# Altium schematic sheet 06 USB & PWR.SchDoc
size 513 x 386 mm
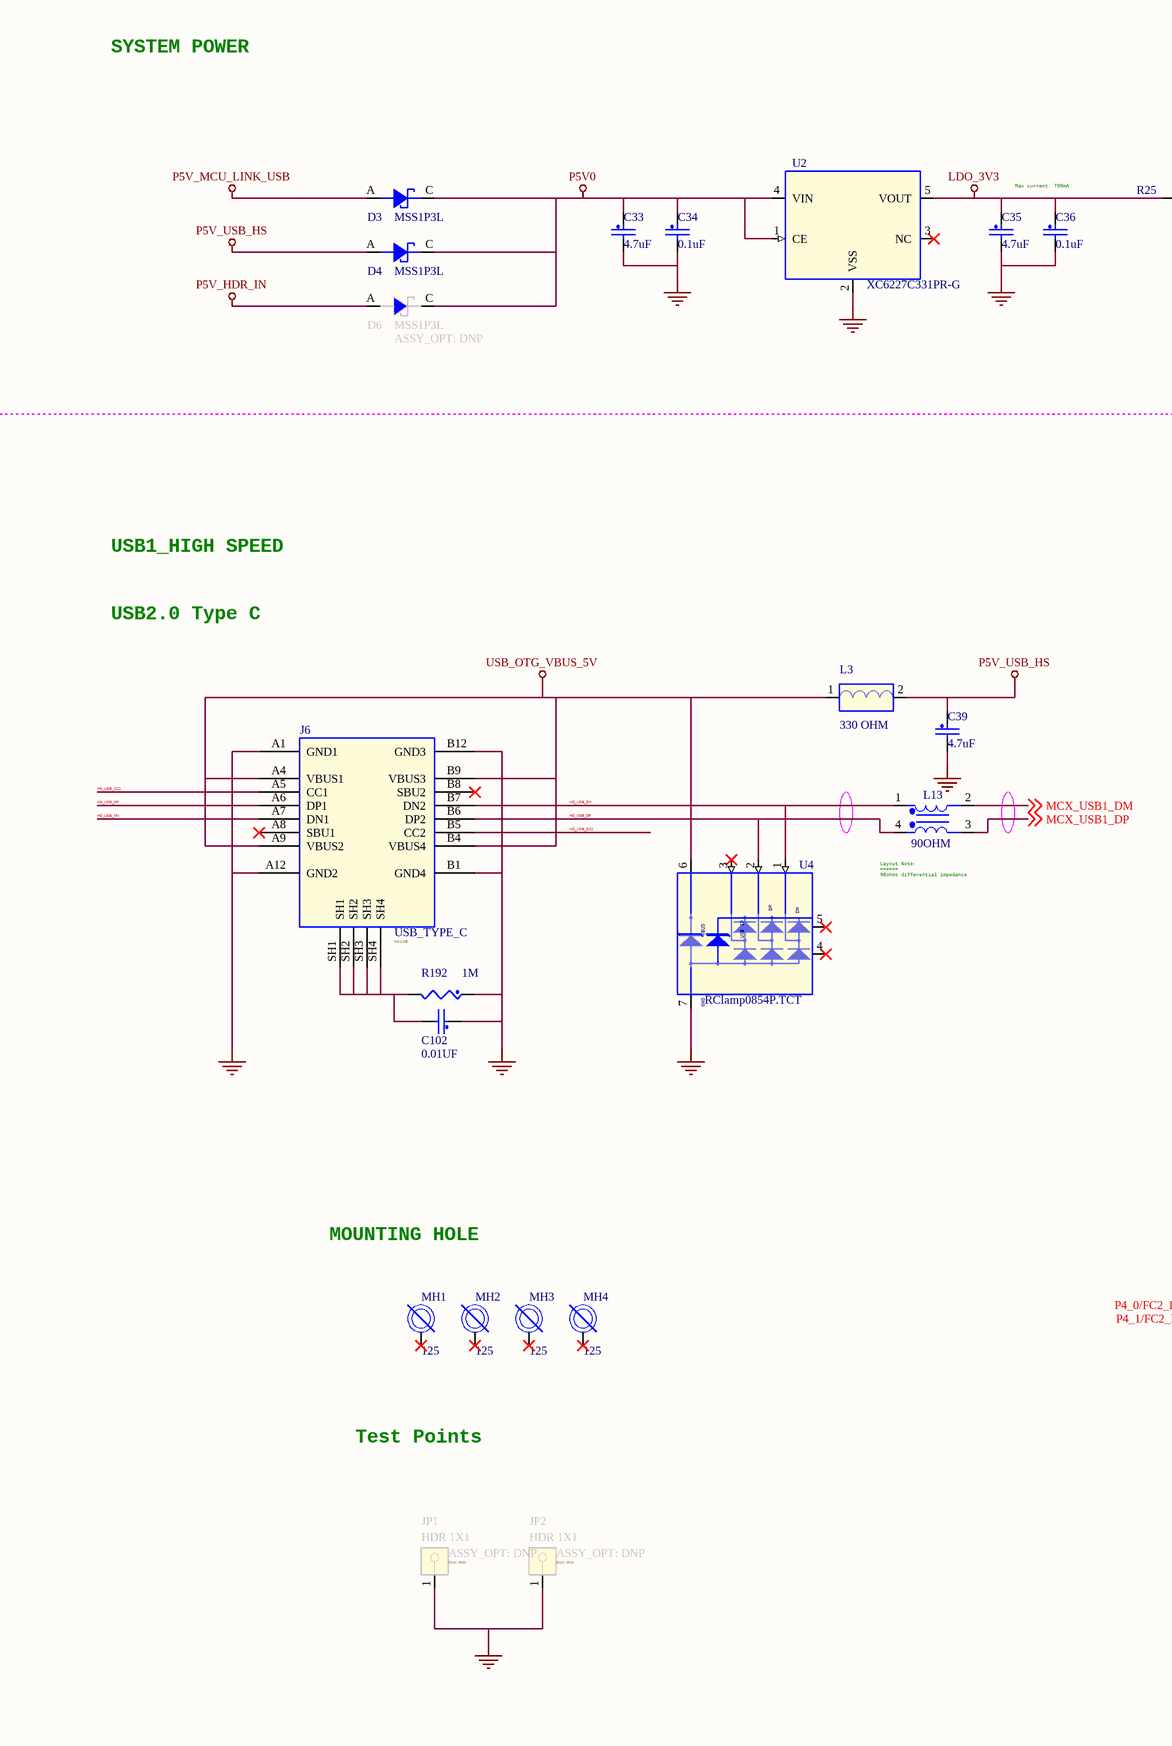
[diagram p0: 06 USB & PWR.SchDoc, left]
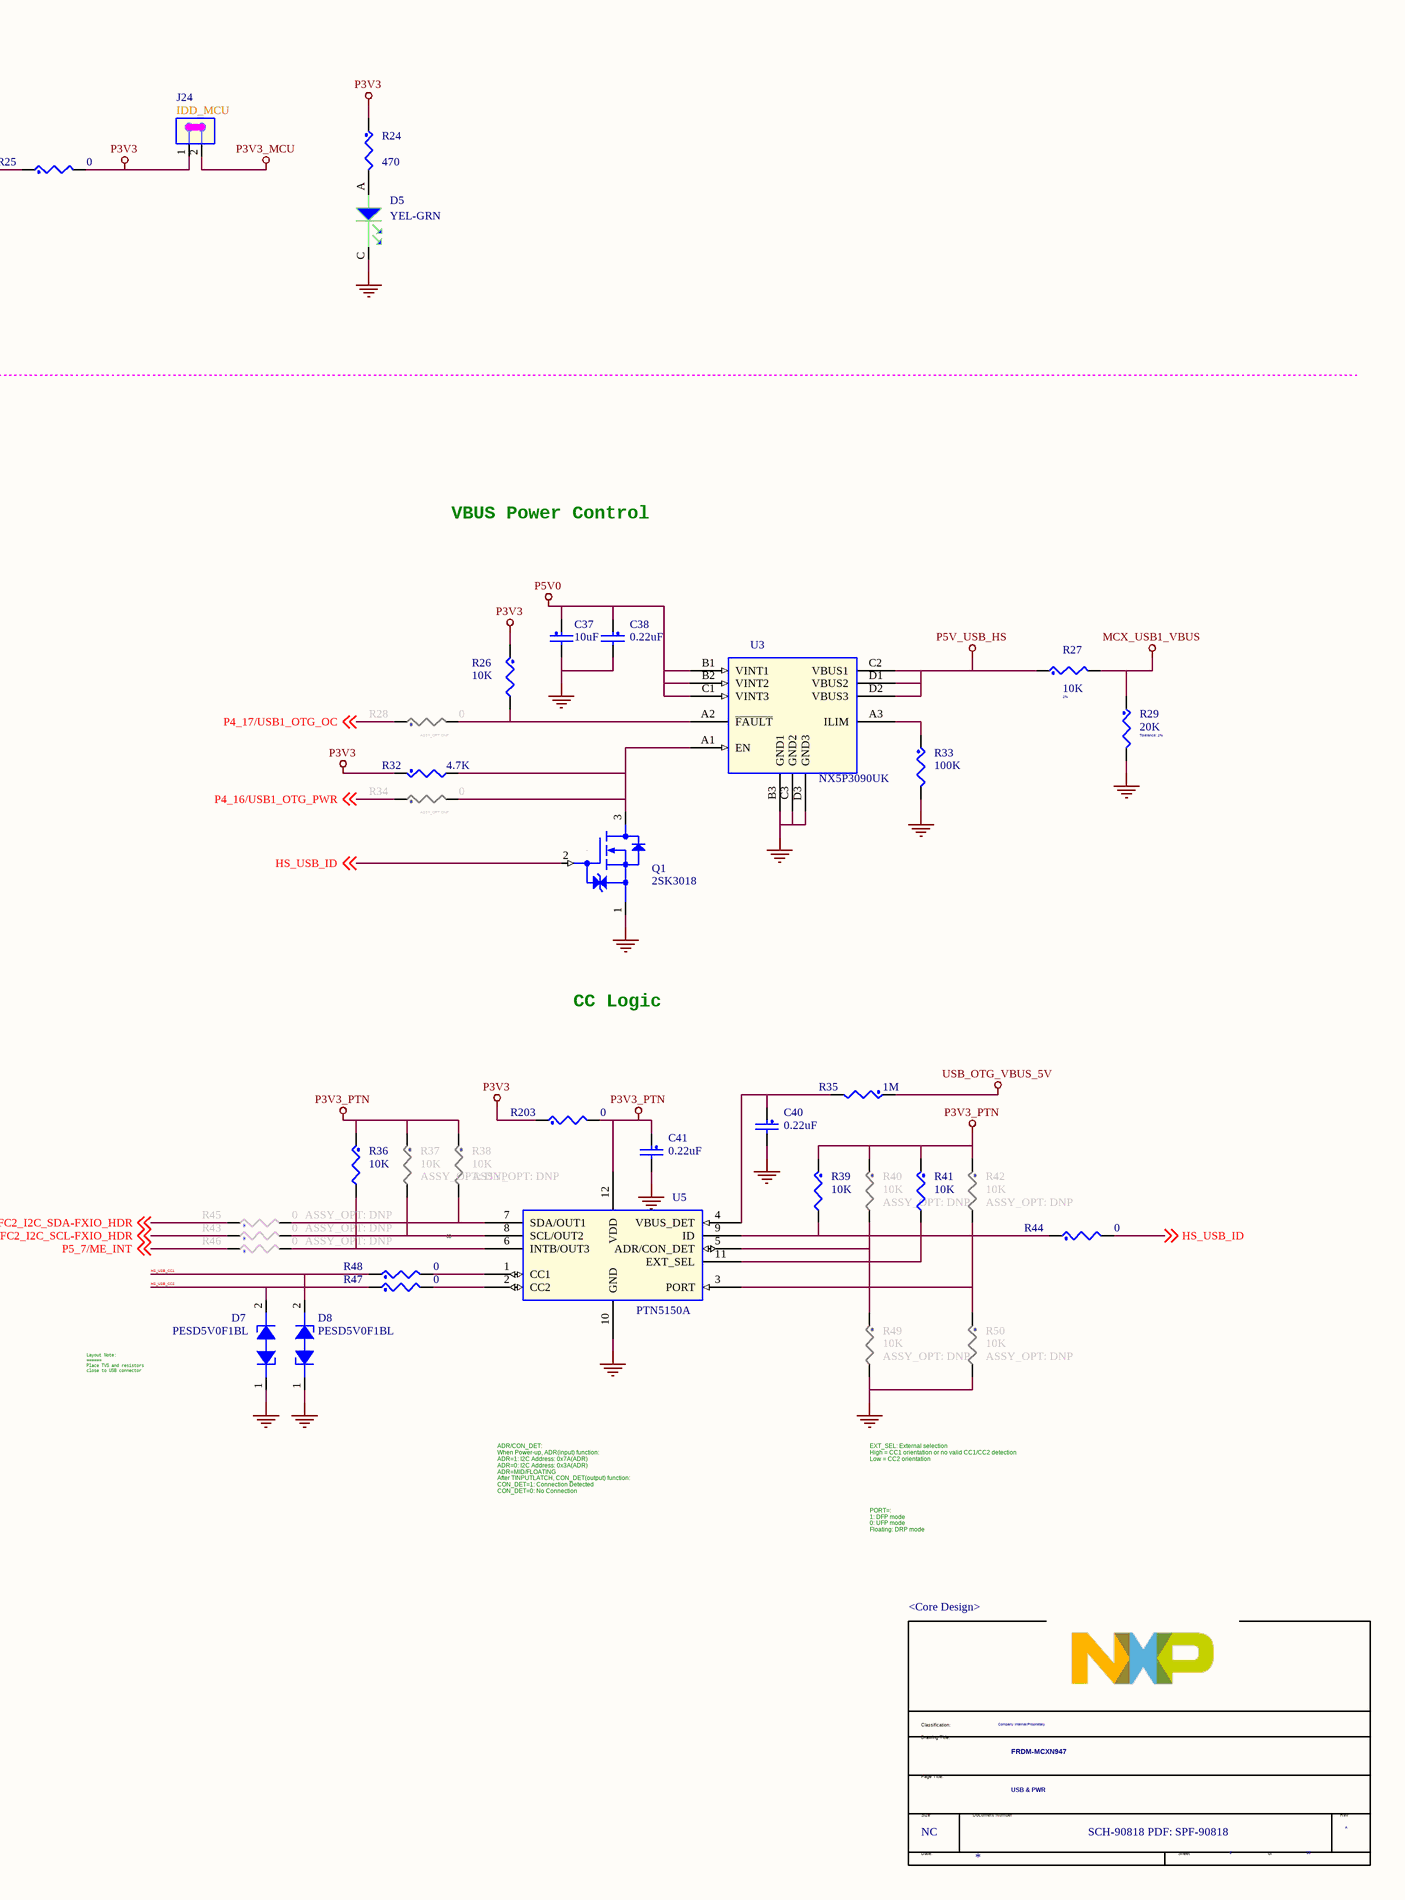
[diagram p1: 06 USB & PWR.SchDoc, right]

## Parts
*  Doc: SCH-90818 PDF: SPF-90818  RevCode: A  Title: FRDM-MCXN947  Page Size: NC  Page Number: 6  Page Count: 13  PageTitle: USB & PWR  Variant Name: <Core Design>  Classification: Company Internal/Proprietary  (hidden comment: TitleBlock_FS)  (graphical)
C33  4.7uF  [CC0603_OV]
C34  0.1uF  [CC0402_25]
C35  4.7uF  [CC0603_OV]
C36  0.1uF  [CC0402_25]
C37  10uF  [CC0603_OV]
C38  0.22uF  [CC0402_25]
C39  4.7uF  [CC0603_OV]
C40  0.22uF  [CC0402_25]
C41  0.22uF  [CC0402_25]
C102  0.01UF  [CC0805_OV]
D3  MSS1P3L  [smb_2p7x1p4]
D4  MSS1P3L  [smb_2p7x1p4]
D5  YEL-GRN  [led_1x0p6_sm]
D6  MSS1P3L  ASSY_OPT: DNP  [smb_2p7x1p4]
D7  PESD5V0F1BL  [sod882]
D8  PESD5V0F1BL  [sod882]
J6  USB_TYPE_C  SILK: HS-USB  [con16_usb_type-c_ra_th]
J24  SILK: IDD_MCU  [hdr1x2_5p48x2p69]  (hidden comment: HDR1X2)
JP1  HDR 1X1  ASSY_OPT: DNP  SILK: GND  [HDR101]
JP2  HDR 1X1  ASSY_OPT: DNP  SILK: GND  [HDR101]
L3  330 OHM  [ind_1608]
L13  90OHM  [ind4_choke_0805_39h]
MH1  125  [MH125-160]
MH2  125  [MH125-160]
MH3  125  [MH125-160]
MH4  125  [MH125-160]
Q1  2SK3018  [SOT323_3]
R24  470  [RC0402_25]
R25  0  [RC0603_OV]
R26  10K  [RC0402_25]
R27  10K  Tolerance: 1%  [RC0402_25]
R28  0  ASSY_OPT: DNP  [RC0603_OV]
R29  20K  Tolerance: 1%  [RC0402_25]
R32  4.7K  [RC0402_25]
R33  100K  [RC0402_25]
R34  0  ASSY_OPT: DNP  [RC0603_OV]
R35  1M  [RC0805_OV]
R36  10K  [RC0402_25]
R37  10K  ASSY_OPT: DNP  [RC0402_25]
R38  10K  ASSY_OPT: DNP  [RC0402_25]
R39  10K  [RC0402_25]
R40  10K  ASSY_OPT: DNP  [RC0402_25]
R41  10K  [RC0402_25]
R42  10K  ASSY_OPT: DNP  [RC0402_25]
R43  0  ASSY_OPT: DNP  [RC0402_25]
R44  0  [RC0603_OV]
R45  0  ASSY_OPT: DNP  [RC0402_25]
R46  0  ASSY_OPT: DNP  [RC0402_25]
R47  0  [RC0402_25]
R48  0  [RC0402_25]
R49  10K  ASSY_OPT: DNP  [RC0402_25]
R50  10K  ASSY_OPT: DNP  [RC0402_25]
R192  1M  [RC0805_OV]
R203  0  [RC0402_25]
U2  XC6227C331PR-G  [SOT89-5]
U3  NX5P3090UK  [wlcsp12_0p4_1p38x1p68mm_smdp]
U4  RClamp0854P.TCT  [slp1616p6]
U5  PTN5150A  [x2qfn12_0p4_1p6x1p6]

## Nets
GND: C33.2 C34.2 C35.2 C36.2 C37.2 C38.2 C39.2 C40.2 C41.2 C102.1 D5.C(CATHODE) D7.1(C1) D8.1(C1) J6.A1(GND1) J6.A12(GND2) J6.B1(GND4) J6.B12(GND3) JP1.1 JP2.1 Q1.1(SOURCE) R29.2 R33.2 R49.2 R50.2 R192.1 U2.2(VSS) U3.B3(GND1) U3.C3(GND2) U3.D3(GND3) U4.7(GND) U5.10(GND)
LDO_3V3: C35.1 C36.1 R25.1 U2.5(VOUT)
MCX_USB1_VBUS: R27.2 R29.1
P3V3: J24.1 R24.1 R25.2 R26.1 R32.1 R203.1
P3V3_MCU: J24.2
P3V3_PTN: C41.1 R36.1 R37.1 R38.1 R39.1 R40.1 R41.1 R42.1 R203.2 U5.12(VDD)
P5V0: C33.1 C34.1 C37.1 C38.1 D3.C D4.C D6.C U2.1(CE) U2.4(VIN) U3.B1(VINT1) U3.B2(VINT2) U3.C1(VINT3)
P5V_HDR_IN: D6.A
P5V_MCU_LINK_USB: D3.A
P5V_USB_HS: C39.1 D4.A L3.2 R27.1 U3.C2(VBUS1) U3.D1(VBUS2) U3.D2(VBUS3)
USB_OTG_VBUS_5V: J6.A4(VBUS1) J6.A9(VBUS2) J6.B4(VBUS4) J6.B9(VBUS3) L3.1 R35.1 U4.6(VBUS)
HS_USB_CC1: D8.2(C2) J6.A5(CC1) R48.1
HS_USB_CC2: D7.2(C2) J6.B5(CC2) R47.1
HS_USB_DN: J6.A7(DN1) J6.B7(DN2) L13.1 U4.1(DM)
HS_USB_DP: J6.A6(DP1) J6.B6(DP2) L13.4 U4.2(DP)
HS_USB_ID: Q1.2(GATE) R44.2 ; off-sheet HS_USB_ID
MCX_USB1_DM: L13.2 ; off-sheet MCX_USB1_DM
MCX_USB1_DP: L13.3 ; off-sheet MCX_USB1_DP
P4_0/FC2_I2C_SDA-FXIO_HDR: R45.1 ; off-sheet P4_0/FC2_I2C_SDA-FXIO_HDR
P4_1/FC2_I2C_SCL-FXIO_HDR: R43.1 ; off-sheet P4_1/FC2_I2C_SCL-FXIO_HDR
P4_16/USB1_OTG_PWR: R34.1 ; off-sheet P4_16/USB1_OTG_PWR
P4_17/USB1_OTG_OC: R28.1 ; off-sheet P4_17/USB1_OTG_OC
P5_7/ME_INT: R46.1 ; off-sheet P5_7/ME_INT
NetC40_1: C40.1 R35.2 U5.4(VBUS_DET)
NetC102_2: C102.2 J6.SH1 J6.SH2 J6.SH3 J6.SH4 R192.2
NetD5_A: D5.A(ANODE) R24.2
NetQ1_3: Q1.3(DRAIN) R32.2 R34.2 U3.A1(EN)
NetR26_2: R26.2 R28.2 U3.A2(~{FAULT})
NetR33_1: R33.1 U3.A3(ILIM)
NetR36_2: R36.2 R46.2 U5.6(INTB/OUT3)
NetR37_2: R37.2 R43.2 U5.8(SCL/OUT2)
NetR38_2: R38.2 R45.2 U5.7(SDA/OUT1)
NetR39_2: R39.2 R44.1 U5.9(ID)
NetR40_2: R40.2 R49.1 U5.5(ADR/CON_DET)
NetR41_2: R41.2 U5.11(EXT_SEL)
NetR42_2: R42.2 R50.1 U5.3(PORT)
NetR47_2: R47.2 U5.2(CC2)
NetR48_2: R48.2 U5.1(CC1)

Not connected (* = marked no-connect by the designer): J6 A8(SBU1)* B8(SBU2)*; MH1 1*; MH2 1*; MH3 1*; MH4 1*; U2 3(NC)*; U4 3(USB_ID)* 4(NC1)* 5(NC2)*

## Notes on the sheet
- SYSTEM POWER
- Max current: 700mA
- USB1_HIGH SPEED
- VBUS Power Control
- USB2.0 Type C
- (near L13) Layout Note:
  ======
  90ohms differential impedance
- CC Logic
- MOUNTING HOLE
- OD
- Test Points
- (near D7) Layout Note:
  ======
  Place TVS and resistors
  close to USB connector
- ADR/CON_DET:
  When Power-up, ADR(input) function:
  ADR=1: I2C Address: 0x7A(ADR)
  ADR=0: I2C Address: 0x3A(ADR)
  ADR=MID/FLOATING
  After TINPUTLATCH, CON_DET(output) function:
  CON_DET=1: Connection Detected
  CON_DET=0: No Connection
- EXT_SEL: External selection
  High = CC1 orientation or no valid CC1/CC2 detection
  Low = CC2 orientation
- PORT=:
  1: DFP mode
  0: UFP mode
  Floating: DRP mode
- (in symbol TitleBlock_FS) Classification:; Drawing Title:; Page Title:; Size; Document Number; Rev; Date:; Sheet; of

## Library data of the parts
* = TitleBlock_FS: Classification: Public, Company Internal/Proprietary, Company Confidential,  Company Secret; OrgName: NXP Semiconductors; OrgAddr1: 6501 William Cannon Drive West; OrgAddr2: Austin, TX 78735-8598; Page Create Date: March  8, 1995; Page Modify Date: *
C33 C35 = CAP_NP: CAP CER 4.7uF 10V 20% X5R 0603; CLASS: DISCRETE; Temp Range: -55C TO 85C; TOL: 10%; FPLIST: CC0603_OV,CC0603,0603_CC; CAD_APPROVED: Yes; MFG_PN01: 885012106012; MFG_NAME01: WURTH ELEKTRONIK; AGILE_PN: 150-81893; ROOM: CPU; SIGNAL_MODEL: DEFAULT_CAPACITOR_220000pF_2_1; 3D_Mechanical_Footprint_File: http://fcl.am.freescale.net/ALLEGRO/step/cc0603_ov.STEP; Rated Voltage: 10V; Package Type: WCAP-CSGP_0603; Package Size: 0603; VOLTAGE: 10V; WVDC: 10V; HEIGHT: 0.87MM; ROHS: Yes; Tolerance: 20%; PCB Footprint: CC0603_OV
C34 C36 = CAP_NP: CAP CER 0.1UF 16V 10% X7R 0402; CLASS: DISCRETE; SIGNAL_MODEL: DEFAULT_CAPACITOR_100000pF_2_1; AGILE_PN: 150-75182; MFG_NAME01: Samsung Electro-Mechanics; MFG_PN01: CL05B104KO5NNNC; CAD_APPROVED: Yes; FPLIST: CC0402_25,CC0402_HD,0402_CC,CAPC0402_L,cc0402_lamp3; Temp_Range: -55°C to +85°C; Temp Range: -55C to +125C; Tolerance: 10%; ROHS: Yes; HEIGHT: 0.635MM; VOLTAGE: 16V; Rated Voltage: 16V; 3D_Mechanical_Footprint_File: http://fcl.am.freescale.net/ALLEGRO/step/cc0402_25.STEP; PCB Footprint: CC0402_25
C37 = CAP_NP: CAP CER 10uF 25V 10% X5R 0603; CLASS: DISCRETE; AGILE_PN: 150-79569; CAD_APPROVED: Yes; MFG_NAME01: SANYEAR; MFG_PN01: C0603X5R106K250NT; Package Size: 0603 [1608 Metric]; HEIGHT: 1MM; Package Type: SMD/SMT; Tolerance: 10%; Rated Voltage: 25V; ROHS: Yes; 3D_Mechanical_Footprint_File: http://fcl.am.freescale.net/ALLEGRO/step/cc0603_ov.STEP; PCB Footprint: CC0603_OV
C38 C40 = CAP_NP: CAP CER 0.22UF 16V 10% X7R 0402; CLASS: DISCRETE; Temp Range: -55C to +125C; FPLIST: CC0402_25,CC0402_HD,0402_CC; CAD_APPROVED: Yes; MFG_PN01: 0402B224K160NT; MFG_NAME01: FENGHUA; AGILE_PN: 150-78886; PCB Footprint: CC0402_25; 3D_Mechanical_Footprint_File: http://fcl.am.freescale.net/ALLEGRO/step/cc0402_25.STEP; Rated Voltage: 16V; Package Type: SMD/SMT; Package Size: 0402 [1005 Metric]; VOLTAGE: 16V; HEIGHT: 0.55MM; ROHS: Yes; Tolerance: 10%
C39 = CAP_NP: CAP CER 4.7uF 10V 20% X5R 0603; CLASS: DISCRETE; Temp Range: -55C TO 85C; FPLIST: CC0603_OV,CC0603,0603_CC; CAD_APPROVED: Yes; MFG_PN01: 885012106012; MFG_NAME01: WURTH ELEKTRONIK; AGILE_PN: 150-81893; 3D_Mechanical_Footprint_File: http://fcl.am.freescale.net/ALLEGRO/step/cc0603_ov.STEP; Rated Voltage: 10V; Package Type: WCAP-CSGP_0603; Package Size: 0603; HEIGHT: 0.87MM; ROHS: Yes; Tolerance: 20%; VOLTAGE: 10V; TOL: 20%; PCB Footprint: CC0603_OV
C41 = CAP_NP: CAP CER 0.22UF 16V 10% X7R 0402; CLASS: DISCRETE; AGILE_PN: 150-78886; MFG_NAME01: FENGHUA; MFG_PN01: 0402B224K160NT; CAD_APPROVED: Yes; FPLIST: CC0402_25,CC0402_HD,0402_CC; Temp Range: -55C to +125C; Tolerance: 10%; ROHS: Yes; HEIGHT: 0.55MM; VOLTAGE: 16V; Package Size: 0402 [1005 Metric]; Package Type: SMD/SMT; Rated Voltage: 16V; 3D_Mechanical_Footprint_File: http://fcl.am.freescale.net/ALLEGRO/step/cc0402_25.STEP; PCB Footprint: CC0402_25
C102 = CAP_NP: CAP CER 0.01UF 50V 10% X7R 0805; CLASS: DISCRETE; AGILE_PN: 150-75010; FPLIST: CC0805_OV,CC0805,0805_CC; CAD_APPROVED: Yes; Temp Range: -55C to +125C; MFG_NAME01: VENKEL COMPANY; MFG_PN01: C0805X7R500-103KNE; Package Size: 0805; HEIGHT: 1.4732 MM; Tolerance: 10%; Rated Voltage: 50V; ROHS: Yes; PCB Footprint: CC0805_OV
D3 D4 = DIODE_SCHTKY: DIODE SCH 1A 30V MICROSMP SMT; CLASS: IC; AGILE_PN: 480-76978; CAD_APPROVED: Yes; MFG_NAME01: VISHAY INTERTECHNOLOGY; MFG_PN01: MSS1P3L-M3/89A; HEIGHT: 0.73MM; Rated Voltage: 30V; 3D_Mechanical_Footprint_File: http://fcl.am.freescale.net/ALLEGRO/step/smb_2p7x1p4.step; PCB Footprint: smb_2p7x1p4
D5 = LED: LED YEL-GRN SGL 25mA SMT 0402; CLASS: IC; MFG_PN01: MHT136CGCT; MFG_NAME01: Lianyungang Meihua Electronics Technology Co.,Ltd; Temp Range: -35¡ãC to +85¡ãC; VOLTAGE: 1.7-2.2V@5mA; CAD_APPROVED: YES; AGILE_PN: 370-76900; PCB Footprint: led_1x0p6_sm; Rated Voltage: 1.7-2.2V@5mA; HEIGHT: 0.35MM; Package Size: 1 x 0.5 x 0.3 mm
D6 = DIODE_SCHTKY: DIODE SCH 1A 30V MICROSMP SMT; CLASS: IC; MFG_PN01: MSS1P3L-M3/89A; MFG_NAME01: VISHAY INTERTECHNOLOGY; CAD_APPROVED: Yes; AGILE_PN: 480-76978; PCB Footprint: smb_2p7x1p4; 3D_Mechanical_Footprint_File: http://fcl.am.freescale.net/ALLEGRO/step/smb_2p7x1p4.step; Rated Voltage: 30V; HEIGHT: 0.73MM
D7 D8 = DIODE_BIDIR: DIODE BIDIR 1-LINE ESD PROT 0.4pF 6V 2.5A AEC-Q101 SOD882; CLASS: IC; MFG_PN01: PESD5V0F1BL,315; MFG_NAME01: NEXPERIA; CAD_APPROVED: Yes; AGILE_PN: 480-78454; 3D_Mechanical_Footprint_File: http://fcl.am.freescale.net/ALLEGRO/step/sod882.STEP; Rated Voltage: 6V; HEIGHT: 0.5 MM; PCB Footprint: sod882
J6 = USB16_TYPEC_4SH: CON 2X8 USB2.0_TYPE_C RCPT 0.85MM 144H AU 63L; CLASS: IO; AGILE_PN: 210-82931; CAD_APPROVED: Yes; Temp Range: -40 ¡ãC to +85 ¡ãC; MFG_NAME01: GCT; MFG_PN01: USB4085-GF-A; HEIGHT: 3.66 MM; Package Type: Through Hole, Right Angle; ROHS: Yes; PCB Footprint: con16_usb_type-c_ra_th
J24 = CONN_HDR_2X1: HDR 1X2 TH 100MIL SP 342H AU 118L; CLASS: IO; JUMPER(DEFAULT): 1-2; AGILE_PN: 210-80468; CAD_APPROVED: Yes; Temp Range: -40¡ãC to 105¡ãC; MFG_NAME01: WURTH ELEKTRONIK EISOS GMBH & CO. KG (ELECTRONIC & ELECTROMEHANICAL COMP); MFG_PN01: 61300211121; HEIGHT: 8.69MM; Package Type: TH; ROHS: Yes; 3D_Mechanical_Footprint_File: http://fcl.am.freescale.net/ALLEGRO/step/hdr1x2_5p48x2p69.STEP; PCB Footprint: hdr1x2_5p48x2p69
JP1 JP2 = CONN_HDR_1X1: HDR 1X1 TH -- 330H AU 100L; CLASS: IO; MFG_PN01: HTSW-101-07-SM-S; MFG_NAME01: SAMTEC; CAD_APPROVED: Yes; AGILE_PN: 210-75767; 3D_Mechanical_Footprint_File: http://fcl.am.freescale.net/ALLEGRO/step/hdr101.STEP; ROHS: Yes; HEIGHT: 8.585 MM; Package Size: 2.54 x 2.54 mm; PCB Footprint: HDR101
L3 = BEAD: IND FER BEAD 330OHM@100MHZ 1.7A 0603; PART_TYPE: FERRITE\BEAD; CLASS: DISCRETE; AGILE_PN: 180-78156; Tolerance: 25%; MFG_NAME01: TDK; MFG_PN01: MPZ1608S331A; CAD_APPROVED: Yes; ROHS: Yes; HEIGHT: 0.95MM; TOL: 25%; PCB Footprint: ind_1608
L13 = DLW43: IND CHK 90 OHM@100MHZ 330MA 25% 0805; CLASS: DISCRETE; AGILE_PN: 180-76336; FPLIST: ind4_choke_0805_39h,ind4_choke_0805; CAD_APPROVED: Yes; Temp Range: -40¡ãC to +85¡ãC; MFG_NAME01: MURATA; MFG_PN01: DLW21HN900SQ2L; PCB Footprint: ind4_choke_0805_39h; HEIGHT: 1MM; ROHS: Yes; 3D_Mechanical_Footprint_File: http://fcl.am.freescale.net/ALLEGRO/step/ind4_choke_0805_39h.STEP
MH1-MH4 = MOUNT_HOLE: NON-PLATED MOUNTING HOLE 125 DRILL / 160 KEEPOUT NO PART TO ORDER; CLASS: IC; AGILE_PN: 510-75297; CAD_APPROVED: Yes; PCB Footprint: MH125-160; HEIGHT: 0.1 MM; ROHS: Yes
Q1 = 2SK3018: TRANS MOSFET N-CH 30V .1A SOT-323; CLASS: IC; MFG_PN01: 2SK3018T106; MFG_NAME01: ROHM; CAD_APPROVED: Yes; AGILE_PN: 480-75317; PCB Footprint: SOT323_3; ROHS: Yes; HEIGHT: 0.9MM
R24 = RES: RES MF 470 OHM 1/16W 5% 0402; CLASS: DISCRETE; Temp_Range: -55&#8451; to 155&#8451;; SIGNAL_MODEL: DEFAULT_RESISTOR_430.000000OHM_2_1; FPLIST: RC0402_25,RC0402_HD,0402_CC; CAD_APPROVED: Yes; MFG_PN01: ERJ2GEJ471X; MFG_NAME01: PANASONIC; AGILE_PN: 470-30315; TOL: 1%; PCB Footprint: RC0402_25; ROHS: Yes; Tolerance: 5%; HEIGHT: 0.45mm
R25 R28 = RES: RES MF ZERO OHM 1/10W -- 0603; CLASS: DISCRETE; AGILE_PN: 470-80866; FPLIST: RC0603_OV,RC0603,R603-X2,r603-x2_b,0603_CC,IND_0603HP_NSP,CC0603_OV_NSP; CAD_APPROVED: Yes; Temp Range: ¨C55 ¡ãC to +155 ¡ãC; MFG_NAME01: YAGEO AMERICA; MFG_PN01: RC0603FR-070RL; PCB Footprint: RC0603_OV; HEIGHT: 0.6MM; ROHS: Yes
R26 R39 R41 = RES: RES MF 10K 1/16W 1% 0402; CLASS: DISCRETE; MFG_PN01: NRCL04F1002TRF; MFG_NAME01: NIC COMPONENTS CORP; CAD_APPROVED: Yes; FPLIST: RC0402_25,RC0402_HD,0402_CC,RC0402_X2; AGILE_PN: 470-80452; ROHS: Yes; Tolerance: 1%; HEIGHT: 0.40 MM; PCB Footprint: RC0402_25
R27 = RES: RES MF 10K 1/16W 1% 0402; CLASS: DISCRETE; Temp_Range: –55 °C to +155 °C; TOL: 5%; FPLIST: RC0402_25,RC0402_HD,0402_CC,RC0402_X2; CAD_APPROVED: Yes; MFG_PN01: NRCL04F1002TRF; MFG_NAME01: NIC COMPONENTS CORP; AGILE_PN: 470-80452; SIGNAL_MODEL: DEFAULT_RESISTOR_10000OHM_2_1; PCB Footprint: RC0402_25; HEIGHT: 0.40 MM; ROHS: Yes
R29 = RES: RES MF 20K 1/16W 1% 0402; CLASS: DISCRETE; AGILE_PN: 470-76103; FPLIST: RC0402_25,RC0402_HD,0402_CC; CAD_APPROVED: Yes; MFG_NAME01: WALSIN TECHNOLOGY CORP.; MFG_PN01: WR04X2002FTL; PCB Footprint: RC0402_25; HEIGHT: 0.4MM; ROHS: Yes
R32 = RES: RES MF 4.7K 1/16W 5% 0402; CLASS: DISCRETE; MFG_PN01: CR0402-JW-472GLF; MFG_NAME01: BOURNS; CAD_APPROVED: Yes; FPLIST: RC0402_25,RC0402_HD,0402_CC,RC0402_X2; AGILE_PN: 470-75626; Pkg: 0402; ROHS: Yes; Tolerance: 5%; HEIGHT: 0.41mm; PCB Footprint: RC0402_25
R33 = RES: RES MF 100K 1/16W 1% 0402; CLASS: DISCRETE; AGILE_PN: 470-76240; FPLIST: RC0402_25,RC0402_HD,0402_CC; CAD_APPROVED: Yes; MFG_NAME01: BOURNS; MFG_PN01: CR0402-FX-1003GLF; HEIGHT: 0.4MM; Tolerance: 1%; ROHS: Yes; PCB Footprint: RC0402_25
R34 R44 = RES: RES MF ZERO OHM 1/10W -- 0603; CLASS: DISCRETE; MFG_PN01: RC0603FR-070RL; MFG_NAME01: YAGEO AMERICA; Temp Range: ¨C55 ¡ãC to +155 ¡ãC; CAD_APPROVED: Yes; FPLIST: RC0603_OV,RC0603,R603-X2,r603-x2_b,0603_CC,IND_0603HP_NSP,CC0603_OV_NSP; AGILE_PN: 470-80866; PCB Footprint: RC0603_OV; ROHS: Yes; HEIGHT: 0.6MM
R35 R192 = RES: RES MF 1M 1/10W 5%  0805; CLASS: DISCRETE; AGILE_PN: 470-76691; FPLIST: RC0805_OV,RC0805,0805_CC; CAD_APPROVED: Yes; Temp Range: -55¡ãC to +175¡ãC; MFG_NAME01: SMEC; MFG_PN01: RC73L2A105JTF; HEIGHT: 0.55MM; Tolerance: 5%; ROHS: Yes; PCB Footprint: RC0805_OV
R36 = RES: RES MF 10K 1/16W 1% 0402; CLASS: DISCRETE; AGILE_PN: 470-80452; FPLIST: RC0402_25,RC0402_HD,0402_CC,RC0402_X2; CAD_APPROVED: Yes; MFG_NAME01: NIC COMPONENTS CORP; MFG_PN01: NRCL04F1002TRF; HEIGHT: 0.40 MM; Tolerance: 1%; ROHS: Yes; PCB Footprint: RC0402_25
R37 R38 R49 = RES: RES MF 10K 1/16W 1% 0402; CLASS: DISCRETE; TOL: 5%; FPLIST: RC0402_25,RC0402_HD,0402_CC,RC0402_X2; CAD_APPROVED: Yes; MFG_PN01: NRCL04F1002TRF; MFG_NAME01: NIC COMPONENTS CORP; AGILE_PN: 470-80452; SIGNAL_MODEL: DEFAULT_RESISTOR_10000OHM_2_1; Temp_Range: –55 °C to +155 °C; PCB Footprint: RC0402_25; HEIGHT: 0.40 MM; ROHS: Yes; Tolerance: 1%
R40 R42 R50 = RES: RES MF 10K 1/16W 1% 0402; CLASS: DISCRETE; Temp_Range: –55 °C to +155 °C; SIGNAL_MODEL: DEFAULT_RESISTOR_10000OHM_2_1; AGILE_PN: 470-80452; MFG_NAME01: NIC COMPONENTS CORP; MFG_PN01: NRCL04F1002TRF; CAD_APPROVED: Yes; FPLIST: RC0402_25,RC0402_HD,0402_CC,RC0402_X2; TOL: 5%; PCB Footprint: RC0402_25; Tolerance: 1%; ROHS: Yes; HEIGHT: 0.40 MM
R43 R45-R48 R203 = RES: RES MF ZERO OHM 1/16W 5% 0402; CLASS: DISCRETE; MFG_PN01: CR0402-J/-000GLF; MFG_NAME01: BOURNS; CAD_APPROVED: Yes; FPLIST: RC0402_25,RC0402_HD,RC0402_X2,0402_CC,rc0402_lamp3; AGILE_PN: 470-75394; PCB Footprint: RC0402_25; ROHS: Yes; Tolerance: 5%; HEIGHT: 0.45 MM
U2 = XC6227C_5P: IC VREG LDO  3.3V 0.7A 1.7-6.0V SOT-89-5; AGILE_PN: 315-80827; CAD_APPROVED: Yes; VOLTAGE: 1.7V ~ 6.0V; MFG_NAME01: TOREX; CLASS: IC; HEIGHT: 1.6MM; ROHS: Yes; MFG_PN01: XC6227C331PR-G; PCB Footprint: SOT89-5
U3 = NX5P3090UK_WLCSP12: IC USB PD TYPE C CURRENT LIMITED PWR SW 2.5-5.5V WLCSP12; MFG_PN01: NX5P3090UK,012; MFG_NAME01: NXP SEMICONDUCTORS; CAD_APPROVED: Yes; AGILE_PN: 312-81574; CLASS: IC; PCB Footprint: wlcsp12_0p4_1p38x1p68mm_smdp; 3D_Mechanical_Footprint_File: http://fcl.am.freescale.net/ALLEGRO/step/wlcsp12_0p4_1p38x1p68mm_smdp.STEP; ROHS: Yes; HEIGHT: 0.565 MM
U4 = RCLAMP1654P_NEW: DIODE TVS ARRAY 3 5.5V SLP1616P6; CLASS: IC; AGILE_PN: 480-78843; MFG_NAME01: SEMTECH CORP; CAD_APPROVED: Yes; 3D_Mechanical_Footprint_File: http://fcl.am.freescale.net/ALLEGRO/step/slp1616p6.step; VOLTAGE: 5.5V; Rated Voltage: 5.5V; MFG_PN01: RClamp0854P.TCT; ROHS: Yes; HEIGHT: 0.65MM; PCB Footprint: slp1616p6
U5 = PTN5150A_X2QFN12: IC CC LOGIC USB TYPE-C 2.7-5.5V X2QFN12; AGILE_PN: 312-81473; CAD_APPROVED: Yes; MFG_NAME01: NXP SEMICONDUCTORS; MFG_PN01: PTN5150AHXMP; CLASS: IC; HEIGHT: 0.4MM; ROHS: Yes; VOLTAGE: 2.7-5.5V; 3D_Mechanical_Footprint_File: http://fcl.am.freescale.net/ALLEGRO/step/x2qfn12_0p4_1p6x1p6.STEP; PCB Footprint: x2qfn12_0p4_1p6x1p6